# Altium schematic sheet ESP07.SchDoc
size A
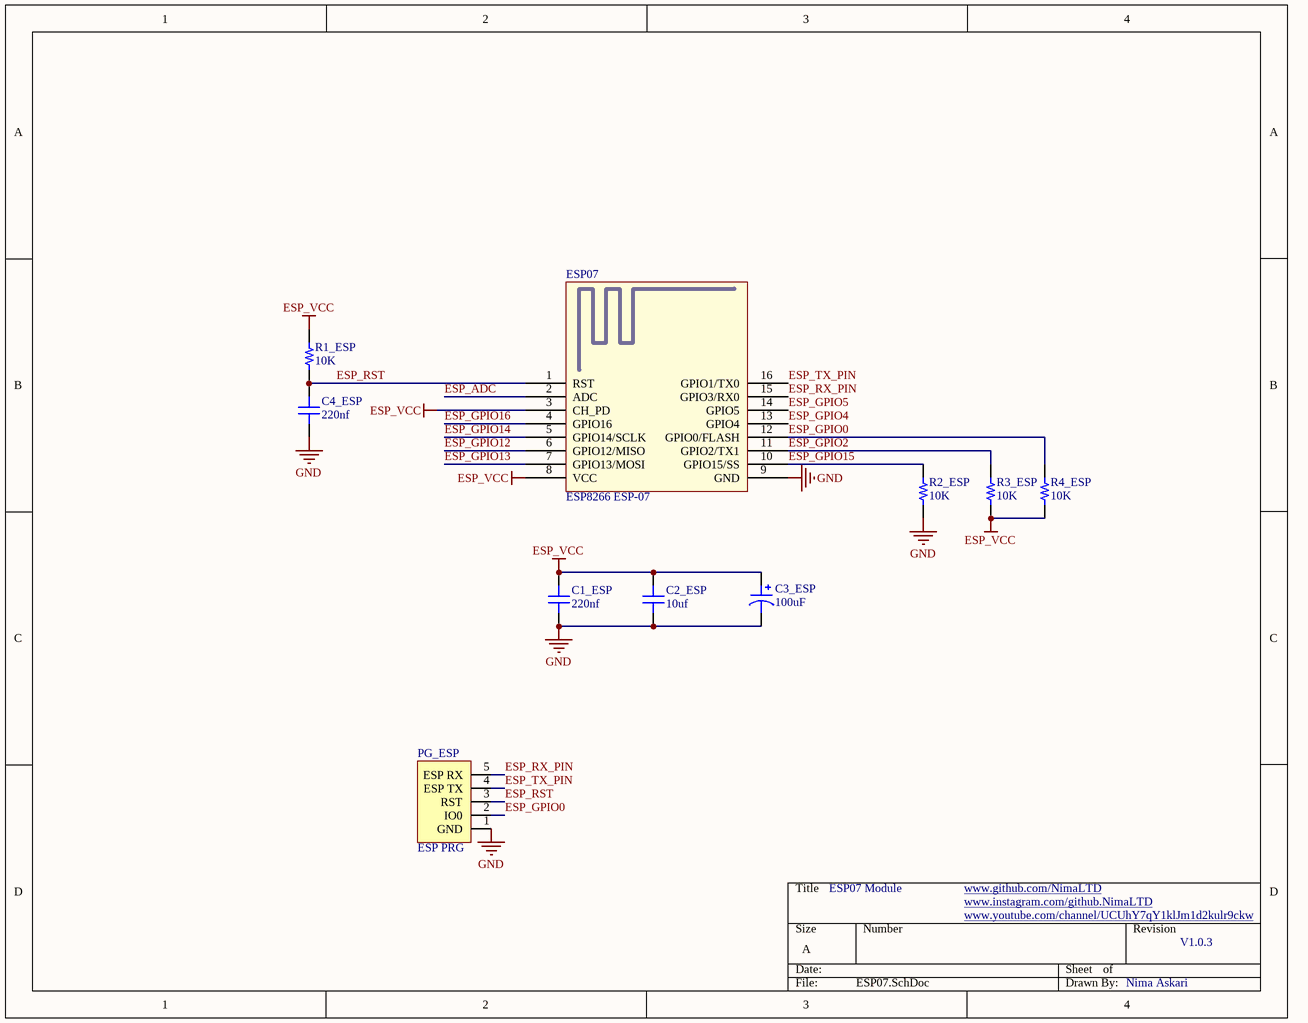
[diagram p0: ESP07.SchDoc]

## Parts
C1_ESP  220nf  [CAP 0805]
C2_ESP  10uf  [CAP 0805]
C3_ESP  100uF  [CAP AL SMD D6 H6]
C4_ESP  220nf  [CAP 0805]
ESP07  ESP8266 ESP-07  [M_ESP07]
PG_ESP  ESP PRG  [HDR2_M_1X5]
R1_ESP  10K  [RES 0805]
R2_ESP  10K  [RES 0805]
R3_ESP  10K  [RES 0805]
R4_ESP  10K  [RES 0805]

## Nets
ESP_VCC: C1_ESP.2 C2_ESP.2 C3_ESP.1 ESP07.3(CH_PD) ESP07.8(VCC) R1_ESP.2 R3_ESP.2 R4_ESP.2
GND: C1_ESP.1 C2_ESP.1 C3_ESP.2 C4_ESP.1 ESP07.9(GND) PG_ESP.1(GND) R2_ESP.2
ESP_ADC: ESP07.2(ADC)
ESP_GPIO0: ESP07.12(GPIO0/FLASH) PG_ESP.2(IO0) R4_ESP.1
ESP_GPIO2: ESP07.11(GPIO2/TX1) R3_ESP.1
ESP_GPIO4: ESP07.13(GPIO4)
ESP_GPIO5: ESP07.14(GPIO5)
ESP_GPIO12: ESP07.6(GPIO12/MISO)
ESP_GPIO13: ESP07.7(GPIO13/MOSI)
ESP_GPIO14: ESP07.5(GPIO14/SCLK)
ESP_GPIO15: ESP07.10(GPIO15/SS) R2_ESP.1
ESP_GPIO16: ESP07.4(GPIO16)
ESP_RST: C4_ESP.2 ESP07.1(RST) PG_ESP.3(RST) R1_ESP.1
ESP_RX_PIN: ESP07.15(GPIO3/RX0) PG_ESP.5(ESP_RX)
ESP_TX_PIN: ESP07.16(GPIO1/TX0) PG_ESP.4(ESP_TX)

## Notes on the sheet
- ESP07 Module
- www.github.com/NimaLTD <http://www.github.com/NimaLTD>
- www.instagram.com/github.NimaLTD <http://www.instagram.com/github.NimaLTD>
- www.youtube.com/channel/UCUhY7qY1klJm1d2kulr9ckw <http://www.youtube.com/channel/UCUhY7qY1klJm1d2kulr9ckw>
- V1.0.3
- Nima Askari

## Library data of the parts
C1_ESP C2_ESP C4_ESP = Cap SMD 0805: SMT Capacitor
  C1_ESP C4_ESP: Value: 220nf
  C2_ESP: Value: 10uf
C3_ESP = Pol Cap SMD AL D6 H6: SMT Polarised Capacitor; Value: 100uF
PG_ESP = ESP PRG P2.0
R1_ESP R2_ESP R3_ESP R4_ESP = Res SMD 0805: SMD Resistor; Value: 10K